# EAGLE design schematic (EAGLE 6.4)
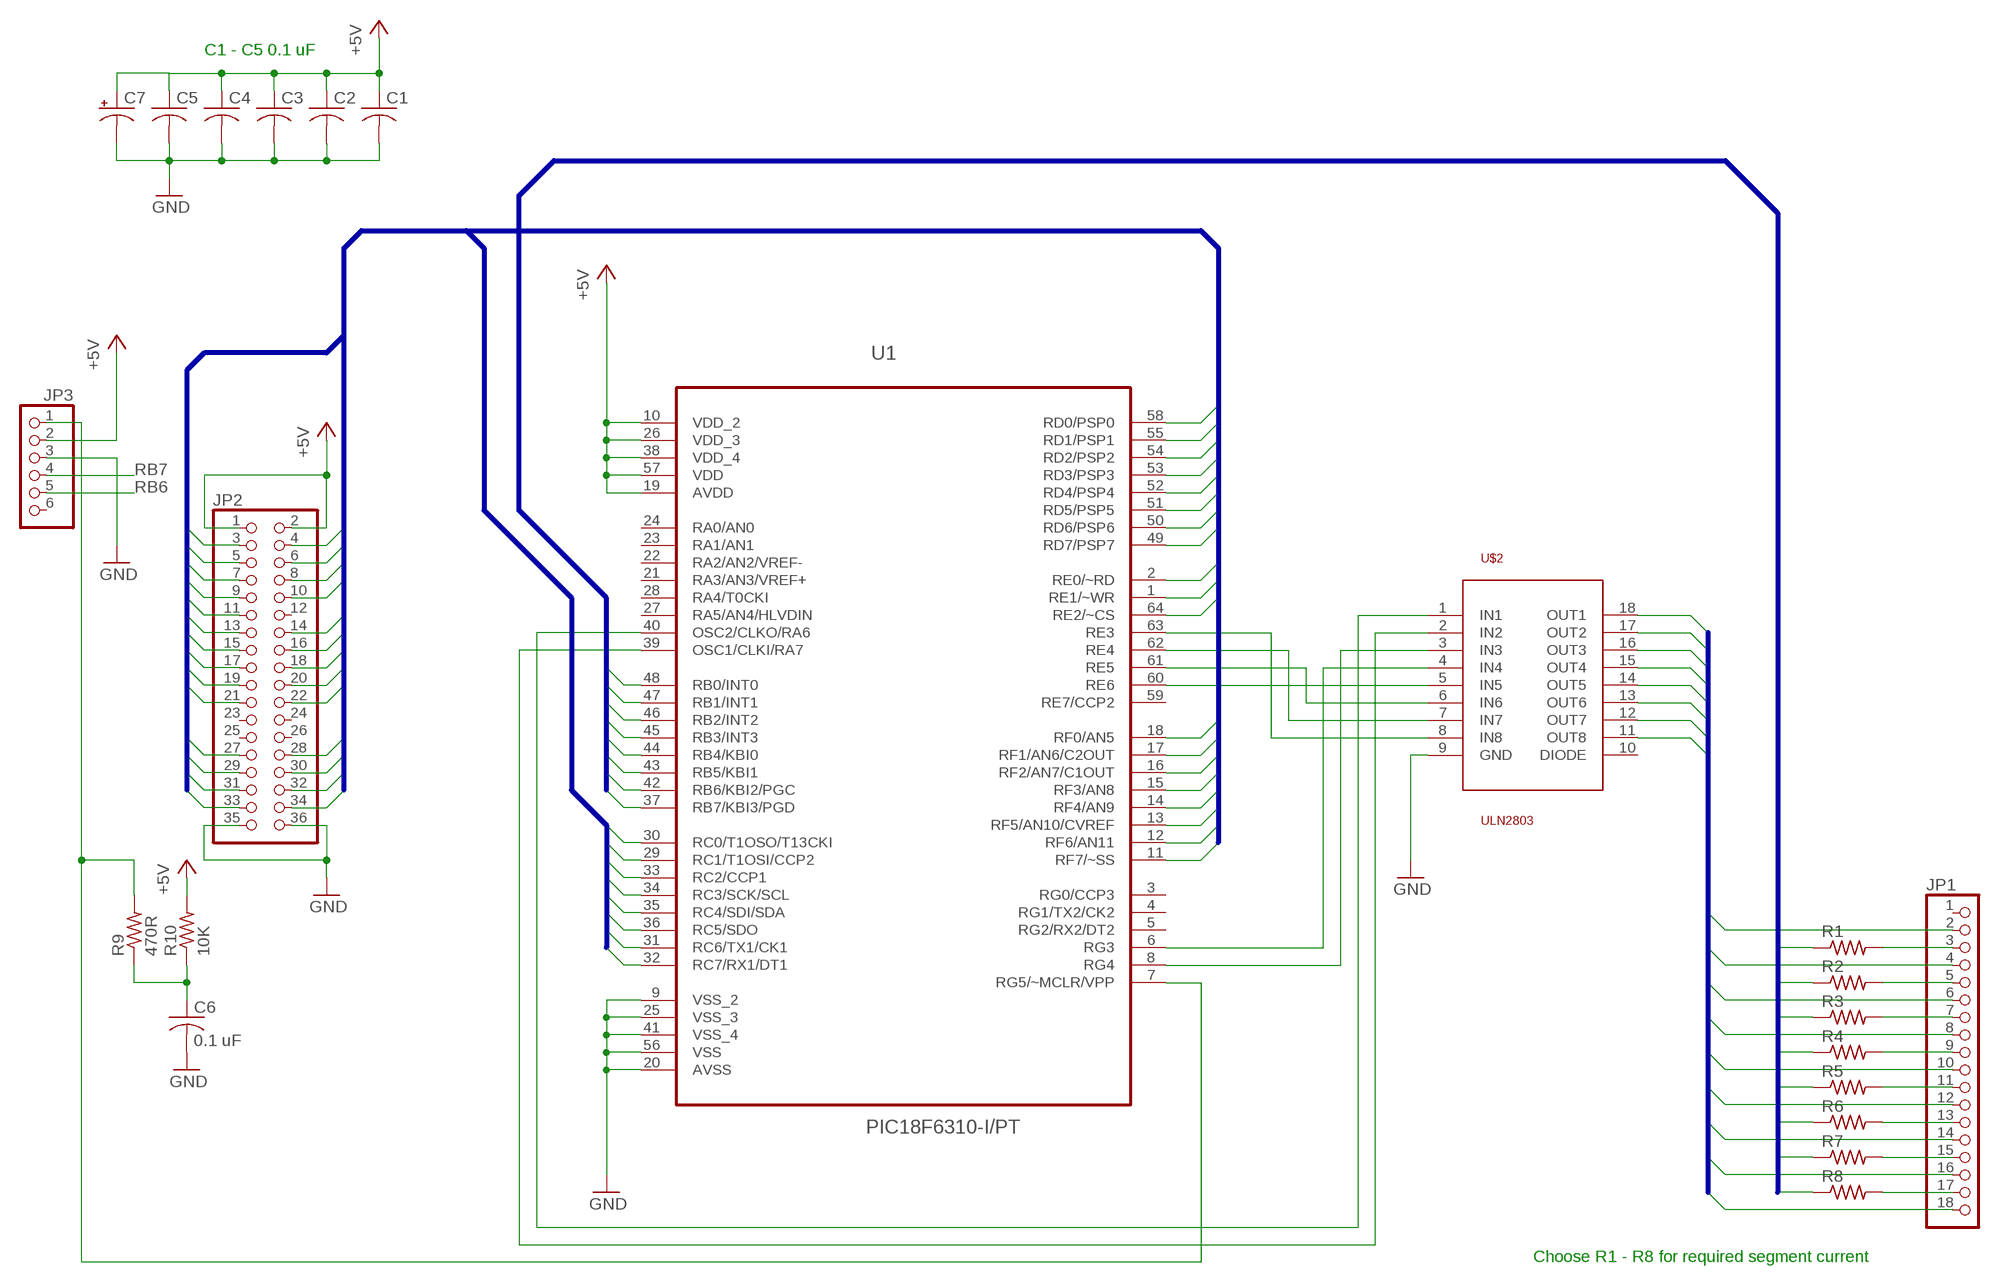
[diagram p0: schematic, sheet 1]

## Parts
C1  C-USC0603K  [C0603K]
C2  C-USC0603K  [C0603K]
C3  C-USC0603K  [C0603K]
C4  C-USC0603K  [C0603K]
C5  C-USC0603K  [C0603K]
C6  0.1 uF  C-USC0603K  [C0603K]
C7  CPOL-USB/3528-21W  [B/3528-21W]
JP1  PINHD-1X18  [1X18]
JP2  PINHD-2X18  [2X18]
JP3  PINHD-1X6  [1X06]
R1  R-US_R0603  [R0603]
R2  R-US_R0603  [R0603]
R3  R-US_R0603  [R0603]
R4  R-US_R0603  [R0603]
R5  R-US_R0603  [R0603]
R6  R-US_R0603  [R0603]
R7  R-US_R0603  [R0603]
R8  R-US_R0603  [R0603]
R9  470R  R-US_R0603  [R0603]
R10  10K  R-US_R0603  [R0603]
U1  PIC18F6310-I/PT  [QFP50P1200X1200X120-64N]
U$2  ULN2803  [SO18L]

## Nets
+5V: C1.1 C2.1 C3.1 C4.1 C5.1 C7.+ JP2.1 JP2.2 JP3.2 R10.2 U1.10(VDD_2) U1.19(AVDD) U1.26(VDD_3) U1.38(VDD_4) U1.57(VDD)
DIGIT0: JP1.2
DIGIT1: JP1.4 U$2.18(OUT1)
DIGIT2: JP1.6 U$2.17(OUT2)
DIGIT3: JP1.8 U$2.16(OUT3)
DIGIT4: JP1.10 U$2.15(OUT4)
DIGIT5: JP1.12 U$2.14(OUT5)
DIGIT6: JP1.14 U$2.13(OUT6)
DIGIT7: JP1.16 U$2.12(OUT7)
DIGIT8: JP1.18 U$2.11(OUT8)
GND: C1.2 C2.2 C3.2 C4.2 C5.2 C6.2 C7.- JP2.35 JP2.36 JP3.3 U1.9(VSS_2) U1.20(AVSS) U1.25(VSS_3) U1.41(VSS_4) U1.56(VSS) U$2.9(GND)
N$2: U1.63(RE3) U$2.8(IN8)
N$3: U1.62(RE4) U$2.7(IN7)
N$4: U1.61(RE5) U$2.6(IN6)
N$5: U1.60(RE6) U$2.5(IN5)
N$6: U1.40(OSC2/CLKO/RA6) U$2.1(IN1)
N$7: U1.39(OSC1/CLKI/RA7) U$2.2(IN2)
N$8: U1.6(RG3) U$2.4(IN4)
N$9: U1.8(RG4) U$2.3(IN3)
N$10: JP3.1 R9.2 U1.7(RG5/~MCLR/VPP)
N$12: JP1.3 R1.2
N$13: JP1.5 R2.2
N$14: JP1.7 R3.2
N$15: JP1.9 R4.2
N$16: JP1.11 R5.2
N$17: C6.1 R9.1 R10.1
N$18: JP1.13 R6.2
N$19: JP1.15 R7.2
N$20: JP1.17 R8.2
RB0: R1.1 U1.48(RB0/INT0)
RB1: R2.1 U1.47(RB1/INT1)
RB2: R3.1 U1.46(RB2/INT2)
RB3: R4.1 U1.45(RB3/INT3)
RB4: R5.1 U1.44(RB4/KBI0)
RB5: R6.1 U1.43(RB5/KBI1)
RB6: JP3.5 R7.1 U1.42(RB6/KBI2/PGC)
RB7: JP3.4 R8.1 U1.37(RB7/KBI3/PGD)
RC0: JP2.27 U1.30(RC0/T1OSO/T13CKI)
RC1: JP2.28 U1.29(RC1/T1OSI/CCP2)
RC2: JP2.29 U1.33(RC2/CCP1)
RC3: JP2.30 U1.34(RC3/SCK/SCL)
RC4: JP2.31 U1.35(RC4/SDI/SDA)
RC5: JP2.32 U1.36(RC5/SDO)
RC6: JP2.33 U1.31(RC6/TX1/CK1)
RC7: JP2.34 U1.32(RC7/RX1/DT1)
RD0: JP2.3 U1.58(RD0/PSP0)
RD1: JP2.4 U1.55(RD1/PSP1)
RD2: JP2.5 U1.54(RD2/PSP2)
RD3: JP2.6 U1.53(RD3/PSP3)
RD4: JP2.7 U1.52(RD4/PSP4)
RD5: JP2.8 U1.51(RD5/PSP5)
RD6: JP2.9 U1.50(RD6/PSP6)
RD7: JP2.10 U1.49(RD7/PSP7)
RE0: JP2.13 U1.2(RE0/~RD)
RE1: JP2.14 U1.1(RE1/~WR)
RE2: JP2.11 U1.64(RE2/~CS)
RF0: JP2.15 U1.18(RF0/AN5)
RF1: JP2.16 U1.17(RF1/AN6/C2OUT)
RF2: JP2.17 U1.16(RF2/AN7/C1OUT)
RF3: JP2.18 U1.15(RF3/AN8)
RF4: JP2.19 U1.14(RF4/AN9)
RF5: JP2.20 U1.13(RF5/AN10/CVREF)
RF6: JP2.21 U1.12(RF6/AN11)
RF7: JP2.22 U1.11(RF7/~SS)
Unconnected: JP1.1 JP2.12 JP2.23 JP2.24 JP2.25 JP2.26 JP3.6 U1.3(RG0/CCP3) U1.4(RG1/TX2/CK2) U1.5(RG2/RX2/DT2) U1.21(RA3/AN3/VREF+) U1.22(RA2/AN2/VREF-) U1.23(RA1/AN1) U1.24(RA0/AN0) U1.27(RA5/AN4/HLVDIN) U1.28(RA4/T0CKI) U1.59(RE7/CCP2) U$2.10(DIODE)

## Buses
CATHODES
PORTB
EXPANSION

## Notes on the sheet
- C1 - C5 0.1 uF
- Choose R1 - R8 for required segment current

## Library data of the parts
C1-C6 = resistor:C-US: CAPACITOR, American symbol
C7 = resistor:CPOL-US: POLARIZED CAPACITOR, American symbol
JP1 = pinhead:PINHD-1X18: PIN HEADER
JP2 = pinhead:PINHD-2X18: PIN HEADER
JP3 = pinhead:PINHD-1X6: PIN HEADER
R1-R10 = resistor:R-US_: RESISTOR, American symbol
U1 = pic18f6310:PIC18F6310-I/PT: IC PIC MCU; MPN: PIC18F6310-I/PT; OC_FARNELL: 1332276; OC_NEWARK: 08J9637; PACKAGE: QFP-64; SUPPLIER: Microchip
U$2 = uln2803:ULN2803

## Board
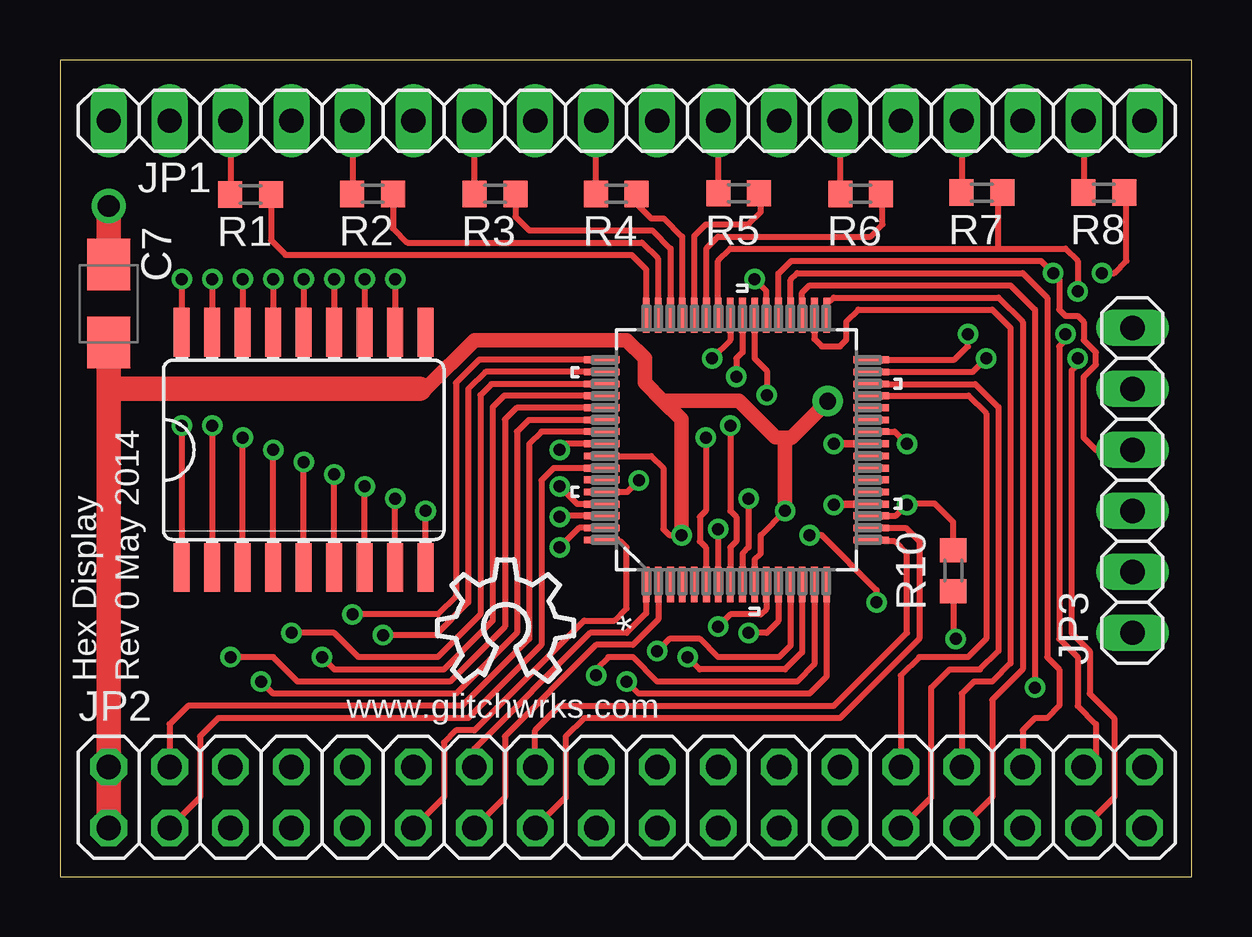
[diagram p1: board, top side]
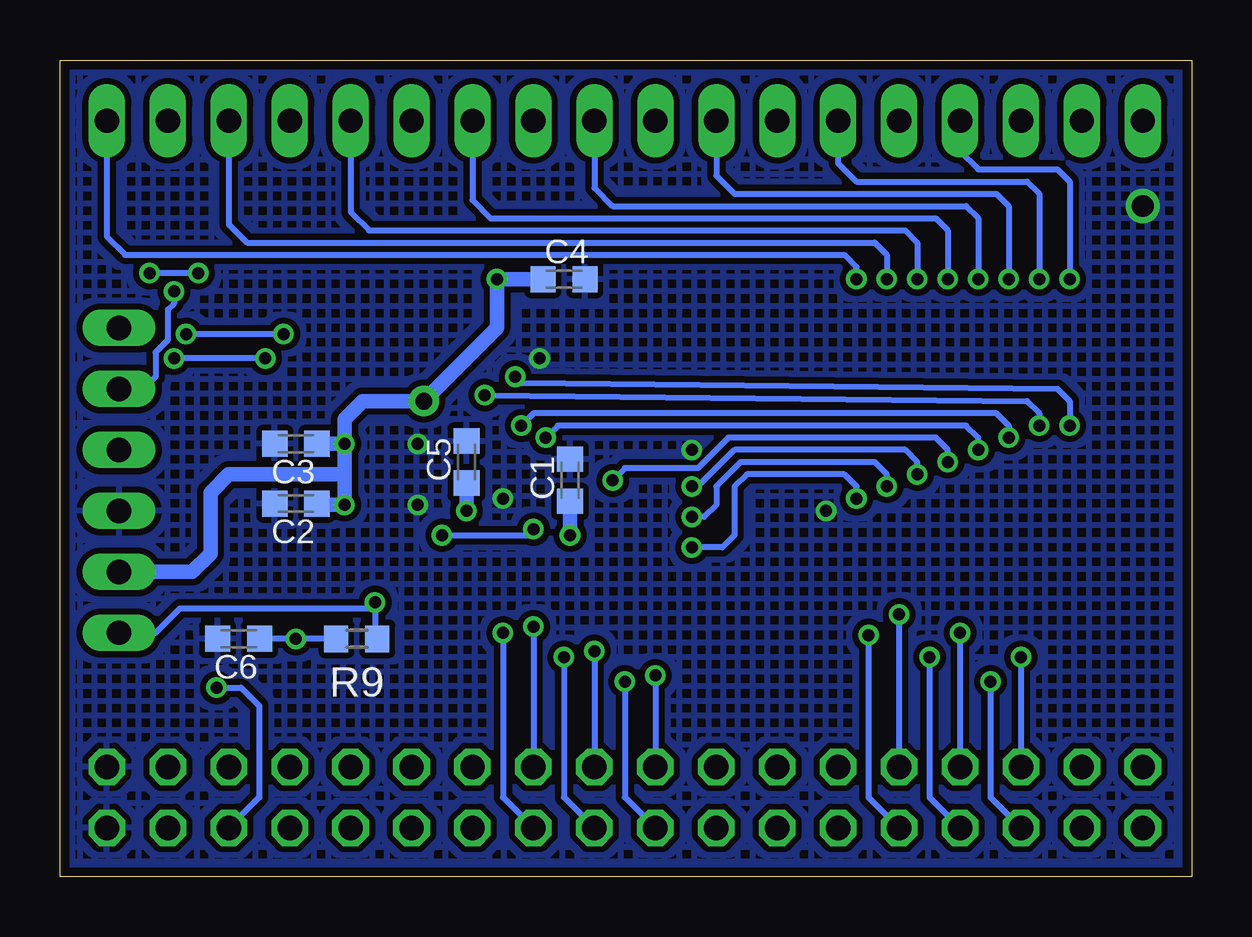
[diagram p2: board, bottom side, seen from below]

Size 47.17 x 34.03 mm. Coordinates in mm from the lower left corner, seen from the top.
Outline: 0,0 47.17,0 47.17,34.03 0,34.03 0,0
Copper layers (1*16): Top 0.0356mm / dielectric 1.5011mm / Bottom 0.0356mm
Design rules "LaenPCBOrder": minimum track width 6mil, minimum drill 13mil, track to track 6mil, track to pad 6mil, pad to pad 6mil, via to via 6mil, smd to smd 6mil, copper to edge 15mil, drill to drill 6mil, minimum pad ring 7mil, minimum via ring 7mil, stop-mask expansion 3mil, vias tented up to drill 0mil, thermal gap 10mil

### Footprints (pad centres in the part's own frame; a part is rotated, then mirrored left to right if it is on the bottom)
C0603K = smd 1.05 x 1.08: 1 -0.875,0; 2 0.875,0
B/3528-21W = smd 2.15 x 1.8: + 1.625,0; - -1.625,0
1X18 = drill 1.016 long: 1 -21.59,0; 2 -19.05,0; 3 -16.51,0; 4 -13.97,0; 5 -11.43,0; 6 -8.89,0; 7 -6.35,0; 8 -3.81,0; 9 -1.27,0; 10 1.27,0; 11 3.81,0; 12 6.35,0; 13 8.89,0; 14 11.43,0; 15 13.97,0; 16 16.51,0; 17 19.05,0; 18 21.59,0
2X18 = drill 1.016 octagon: 1 -21.59,-1.27; 2 -21.59,1.27; 3 -19.05,-1.27; 4 -19.05,1.27; 5 -16.51,-1.27; 6 -16.51,1.27; 7 -13.97,-1.27; 8 -13.97,1.27; 9 -11.43,-1.27; 10 -11.43,1.27; 11 -8.89,-1.27; 12 -8.89,1.27; 13 -6.35,-1.27; 14 -6.35,1.27; 15 -3.81,-1.27; 16 -3.81,1.27; 17 -1.27,-1.27; 18 -1.27,1.27; 19 1.27,-1.27; 20 1.27,1.27; 21 3.81,-1.27; 22 3.81,1.27; 23 6.35,-1.27; 24 6.35,1.27; 25 8.89,-1.27; 26 8.89,1.27; 27 11.43,-1.27; 28 11.43,1.27; 29 13.97,-1.27; 30 13.97,1.27; 31 16.51,-1.27; 32 16.51,1.27; 33 19.05,-1.27; 34 19.05,1.27; 35 21.59,-1.27; 36 21.59,1.27
1X06 = drill 1.016 long: 1 -6.35,0; 2 -3.81,0; 3 -1.27,0; 4 1.27,0; 5 3.81,0; 6 6.35,0
R0603 = smd 1 x 1.1: 1 -0.85,0; 2 0.85,0
QFP50P1200X1200X120-64N = smd 1.473 x 0.279: 1 -5.613,3.759; 2 -5.613,3.251; 3 -5.613,2.743; 4 -5.613,2.261; 5 -5.613,1.753; 6 -5.613,1.245; 7 -5.613,0.762; 8 -5.613,0.254; 9 -5.613,-0.254; 10 -5.613,-0.762; 11 -5.613,-1.245; 12 -5.613,-1.753; 13 -5.613,-2.261; 14 -5.613,-2.743; 15 -5.613,-3.251; 16 -5.613,-3.759; 33 5.613,-3.759; 34 5.613,-3.251; 35 5.613,-2.743; 36 5.613,-2.261; 37 5.613,-1.753; 38 5.613,-1.245; 39 5.613,-0.762; 40 5.613,-0.254; 41 5.613,0.254; 42 5.613,0.762; 43 5.613,1.245; 44 5.613,1.753; 45 5.613,2.261; 46 5.613,2.743; 47 5.613,3.251; 48 5.613,3.759 | smd 0.279 x 1.473: 17 -3.759,-5.613; 18 -3.251,-5.613; 19 -2.743,-5.613; 20 -2.261,-5.613; 21 -1.753,-5.613; 22 -1.245,-5.613; 23 -0.762,-5.613; 24 -0.254,-5.613; 25 0.254,-5.613; 26 0.762,-5.613; 27 1.245,-5.613; 28 1.753,-5.613; 29 2.261,-5.613; 30 2.743,-5.613; 31 3.251,-5.613; 32 3.759,-5.613; 49 3.759,5.613; 50 3.251,5.613; 51 2.743,5.613; 52 2.261,5.613; 53 1.753,5.613; 54 1.245,5.613; 55 0.762,5.613; 56 0.254,5.613; 57 -0.254,5.613; 58 -0.762,5.613; 59 -1.245,5.613; 60 -1.753,5.613; 61 -2.261,5.613; 62 -2.743,5.613; 63 -3.251,5.613; 64 -3.759,5.613
SO18L = smd 0.66 x 2.032: 1 -5.08,-4.902; 2 -3.81,-4.902; 3 -2.54,-4.902; 4 -1.27,-4.902; 5 0,-4.902; 6 1.27,-4.902; 7 2.54,-4.902; 8 3.81,-4.902; 9 5.08,-4.902; 10 5.08,4.902; 11 3.81,4.902; 12 2.54,4.902; 13 1.27,4.902; 14 0,4.902; 15 -1.27,4.902; 16 -2.54,4.902; 17 -3.81,4.902; 18 -5.08,4.902

### Placement (x,y rotation side)
C1  25.91,16.51 90 bottom
C2  37.34,15.54 180 bottom
C3  37.34,18.03 180 bottom
C4  26.16,24.89 0 bottom
C5  30.23,17.27 90 bottom
C6  39.73,9.91 180 bottom
C7  2.03,23.88 270 top
JP1  23.62,31.5 0 top
JP2  23.62,3.3 0 top
JP3  44.7,16.51 90 top
R1  7.95,28.42 180 top
R2  13.03,28.45 180 top
R3  18.14,28.45 180 top
R4  23.19,28.45 180 top
R5  28.3,28.47 180 top
R6  33.38,28.45 180 top
R7  38.43,28.5 180 top
R8  43.51,28.5 180 top
R9  34.8,9.91 0 bottom
R10  37.24,12.75 90 top
U1  28.19,17.78 90 top
U$1  [OSHW_8X200_NOTEXT]  15.75,8.13 0 top
U$2  10.16,17.78 0 top

### Tracks (layer width: path | path; a pad name or v marks a point on that pad's centre or on a via)
+5V  (via drill 0.5, 0.7 pad 1.27)
  Top 0.254: v30.23,15.24 29.21,14.22 29.21,13.46 28.96,13.21 U1.10 | v35.31,18.03 34.8,18.54 U1.26 | v28.96,24.89 29.44,24.41 U1.38 | U1.19 34.85,15.04 v35.31,15.49 35.36,15.54 C2.1 37.24,14.77 R10.2 | U1.57 24.64,17.53 25.15,17.02 25.15,14.48 25.4,14.22 v25.91,14.22
  Top 0.61: 14.99,20.32 15.24,20.32 17.27,22.35 23.62,22.35 24.38,21.59 24.38,20.57 25.12,19.84 | v25.91,14.22 25.91,19.05 25.12,19.84 | v32,19.81 30.48,18.29 30.23,18.29 | 30.23,18.29 29.82,18.31 28.3,19.84 25.12,19.84 | v30.23,15.24 30.23,18.29
  Top 1.016: JP2.1 JP2.2 2.03,20.57 | 2.03,20.57 C7.+ | 14.99,20.32 2.29,20.32 2.03,20.57
  Bottom 0.254: 25.77,15.49 C1.1
  Bottom 0.61: v35.31,18.03 35.31,16.76 | 35.31,16.76 v35.31,15.49 36.41,15.49 C2.1 | v35.31,18.03 35.31,19.05 34.54,19.81 v32,19.81 28.96,22.86 v28.96,24.89 C4.1 | v35.31,18.03 C3.1 | v30.23,15.24 C5.1 | C1.1 v25.91,14.22 | JP3.2 41.66,12.7 40.89,13.46 40.89,16 40.13,16.76 35.31,16.76
DIGIT1  (via drill 0.5)
  Top 0.254: v5.08,24.89 U$2.18
  Bottom 0.254: v5.08,24.89 5.08,28.96 5.59,29.46 8.89,29.46 9.65,30.23 JP1.4
DIGIT2  (via drill 0.5)
  Top 0.254: v6.35,24.89 U$2.17
  Bottom 0.254: v6.35,24.89 6.35,28.45 6.86,28.96 13.97,28.96 14.73,29.72 JP1.6
DIGIT3  (via drill 0.5)
  Top 0.254: v7.62,24.89 U$2.16
  Bottom 0.254: v7.62,24.89 7.62,27.94 8.13,28.45 19.05,28.45 19.81,29.21 JP1.8
DIGIT4  (via drill 0.5)
  Top 0.254: v8.89,24.89 U$2.15
  Bottom 0.254: v8.89,24.89 8.89,27.43 9.4,27.94 24.13,27.94 24.89,28.7 JP1.10
DIGIT5  (via drill 0.5)
  Top 0.254: v10.16,24.89 U$2.14
  Bottom 0.254: v10.16,24.89 10.16,26.92 10.67,27.43 29.21,27.43 29.97,28.19 JP1.12
DIGIT6  (via drill 0.5)
  Top 0.254: v11.43,24.89 U$2.13
  Bottom 0.254: v11.43,24.89 11.43,26.42 11.94,26.92 34.29,26.92 35.05,27.69 JP1.14
DIGIT7  (via drill 0.5)
  Top 0.254: v12.7,24.89 U$2.12
  Bottom 0.254: v12.7,24.89 12.7,25.91 13.21,26.42 39.37,26.42 40.13,27.18 JP1.16
DIGIT8  (via drill 0.5)
  Top 0.254: v13.97,24.89 U$2.11
  Bottom 0.254: v13.97,24.89 13.97,25.4 14.48,25.91 44.45,25.91 45.21,26.67 JP1.18
GND  (via drill 0.5, 0.5 pad 0.41, 0.9 pad 1.42)
  Top 0.254: U$2.9 v15.24,15.24 | v28.7,15.75 28.7,13.72 28.45,13.46 U1.9 | U1.56 21.08,18.03 v20.83,17.78 | U1.41 27.94,22.35 v27.18,21.59
  Top 0.305: U1.20 32.28,15.52 v32.26,15.49 | U1.25 v32.26,18.03
  Top 1.016: v2.03,27.94 C7.-
  pour Bottom (isolate 0.254, hatched): 0,34.04 0,0 47.24,0 47.24,34.04
N$2  (via drill 0.5)
  Top 0.254: U$2.8 v13.97,15.75 | U1.63 21.64,14.53 v20.83,13.72
  Bottom 0.254: v13.97,15.75 13.97,16.26 14.48,16.76 18.54,16.76 19.05,16.26 19.05,14.22 19.56,13.72 v20.83,13.72
N$3  (via drill 0.5)
  Top 0.254: U$2.7 v12.7,16.26 | U1.62 20.88,15.04 v20.83,14.99
  Bottom 0.254: v12.7,16.26 12.7,16.76 13.21,17.27 18.8,17.27 19.81,16.26 19.81,15.49 20.32,14.99 v20.83,14.99
N$4  (via drill 0.5)
  Top 0.254: U$2.6 v11.43,16.76 | U1.61 21.57,15.52 v20.83,16.26
  Bottom 0.254: v11.43,16.76 11.43,17.27 11.94,17.78 19.05,17.78 20.57,16.26 v20.83,16.26
N$5  (via drill 0.5)
  Top 0.254: U1.60 23.65,16.03 v24.13,16.51 | U$2.5 v10.16,17.27
  Bottom 0.254: v10.16,17.27 10.16,17.78 10.67,18.29 19.3,18.29 20.57,17.02 23.62,17.02 v24.13,16.51
N$6  (via drill 0.5)
  Top 0.254: U1.40 28.45,21.84 28.19,21.59 v28.19,20.83 | v5.08,18.8 U$2.1
  Bottom 0.254: v28.19,20.83 27.94,20.57 5.59,20.32 5.08,19.81 v5.08,18.8
N$7  (via drill 0.5)
  Top 0.254: U1.39 28.96,21.59 29.46,21.08 v29.46,20.07 | v6.35,18.8 U$2.2
  Bottom 0.254: v29.46,20.07 6.86,19.81 6.35,19.3 v6.35,18.8
N$8  (via drill 0.5)
  Top 0.254: U$2.4 v8.89,17.78 | v26.92,18.29 26.92,15.24 26.67,14.99 26.67,13.97 26.92,13.72 26.92,12.19 U1.6
  Bottom 0.254: v8.89,17.78 8.89,18.29 9.4,18.8 26.42,18.8 v26.92,18.29
N$9  (via drill 0.5)
  Top 0.254: U$2.3 v7.62,18.29 | v27.94,18.8 27.94,15.24 28.19,14.99 28.19,13.97 27.94,13.72 U1.8
  Bottom 0.254: v27.94,18.8 27.43,19.3 8.13,19.3 7.62,18.8 v7.62,18.29
N$10  (via drill 0.5)
  Top 0.254: v31.24,14.22 31.75,14.22 34.04,11.94 v34.04,11.43 | v27.43,14.48 U1.7
  Bottom 0.254: v31.24,14.22 27.69,14.22 v27.43,14.48 | R9.2 34.04,9.99 v34.04,11.43 34.29,11.18 42.16,11.18 43.18,10.16 JP3.1
N$12
  Top 0.254: JP1.3 7.11,28.43 R1.2
N$13
  Top 0.254: JP1.5 12.19,28.46 R2.2
N$14
  Top 0.254: R3.2 17.29,31.48 JP1.7
N$15
  Top 0.254: R4.2 22.34,31.48 JP1.9
N$16
  Top 0.254: JP1.11 27.43,28.49 R5.2
N$17  (via drill 0.5)
  Top 0.254: R10.1 37.24,10.01 v37.34,9.91
  Bottom 0.254: R9.1 v37.34,9.91 C6.1
N$18
  Top 0.254: JP1.13 32.51,28.46 R6.2
N$19
  Top 0.254: JP1.15 37.59,28.51 R7.2
N$20
  Top 0.254: JP1.17 42.67,28.51 R8.2
RB0
  Top 0.254: U1.48 24.43,25.3 23.82,25.91 9.4,25.91 8.8,26.51 R1.1
RB1
  Top 0.254: U1.47 24.92,23.42 24.92,25.76 24.26,26.42 14.48,26.42 13.88,27.01 R2.1
RB2
  Top 0.254: U1.46 25.45,26.16 24.69,26.92 19.56,26.92 18.99,27.5 R3.1
RB3
  Top 0.254: U1.45 25.93,26.67 25.17,27.43 24.64,27.43 24.04,28.03 R4.1
RB4
  Top 0.254: U1.44 26.44,26.7 26.92,27.18 28.7,27.18 29.21,27.69 29.21,28.41 R5.1
RB5
  Top 0.254: U1.43 26.95,26.19 27.43,26.67 33.78,26.67 34.29,27.18 34.29,28.38 R6.1
RB6  (via drill 0.5)
  Top 0.254: U1.42 27.43,25.65 27.94,26.16 39.12,26.16 | 39.12,26.16 39.12,28.34 R7.1 | 39.12,26.16 41.91,26.16 42.42,25.65 v42.42,24.38
  Bottom 0.254: JP3.5 43.69,20.32 43.18,20.83 43.18,21.84 42.67,22.35 42.67,23.62 42.42,23.88 v42.42,24.38
RB7  (via drill 0.5)
  Top 0.254: U1.37 29.95,25.12 30.48,25.65 40.89,25.65 v41.4,25.15 41.66,24.89 41.66,23.62 41.91,23.37 42.42,23.37 42.67,23.11 42.67,22.35 43.18,21.84 43.18,21.34 42.67,20.83 42.67,18.29 43.18,17.78 JP3.4 | R8.1 44.45,28.41 44.45,25.65 43.94,25.15 v43.43,25.15
  Bottom 0.254: v41.4,25.15 v43.43,25.15
RC0
  Top 0.254: U1.30 38.15,20.52 39.12,19.56 39.12,9.4 38.35,8.64 37.08,8.64 36.32,7.87 36.32,3.3 JP2.27
RC1
  Top 0.254: U1.29 37.87,20.04 38.61,19.3 38.61,9.91 37.85,9.14 35.81,9.14 35.05,8.38 JP2.28
RC2
  Top 0.254: JP2.29 38.86,3.3 38.86,7.37 40.13,8.64 40.13,23.11 39.12,24.13 32.26,24.13 31.95,23.82 U1.33
RC3
  Top 0.254: JP2.30 37.59,7.62 38.1,8.13 38.86,8.13 39.62,8.89 39.62,22.86 38.86,23.62 33.27,23.62 32.77,23.11 32.77,22.35 32.51,22.1 31.75,22.1 31.45,22.4 U1.34
RC4  (via drill 0.5)
  Top 0.254: U1.35 30.94,24.33 31.24,24.64 39.62,24.64 40.64,23.62 v40.64,7.87
  Bottom 0.254: v40.64,7.87 39.62,7.87 38.86,7.11 38.86,3.3 JP2.31
RC5
  Top 0.254: U1.36 30.45,24.87 30.73,25.15 40.13,25.15 41.15,24.13 41.15,9.14 41.66,8.64 41.66,7.11 41.15,6.6 40.64,6.6 40.13,6.1 JP2.32
RC6  (via drill 0.5)
  Top 0.254: U1.31 38.05,21.03 v38.61,21.59 | JP2.33 43.94,3.3 43.94,6.6 42.93,7.62 42.93,9.4 42.16,10.16 42.16,21.08 42.42,21.34 v42.42,21.59
  Bottom 0.254: v38.61,21.59 v42.42,21.59
RC7  (via drill 0.5)
  Top 0.254: JP2.34 43.18,5.08 43.18,6.35 42.42,7.11 42.42,9.14 41.66,9.91 41.66,22.1 41.91,22.35 v41.91,22.61 | U1.32 37.29,21.54 37.85,22.1 v37.85,22.61
  Bottom 0.254: v37.85,22.61 v41.91,22.61
RD0
  Top 0.254: U1.58 20.57,17.02 20.07,16.51 20.07,9.65 17.02,6.6 6.6,6.6 5.84,5.84 5.84,3.3 JP2.3
RD1
  Top 0.254: U1.55 20.07,18.54 19.56,18.03 19.56,9.91 16.76,7.11 5.33,7.11 4.57,6.35 JP2.4
RD2  (via drill 0.5)
  Top 0.254: U1.54 19.53,19.02 19.05,18.54 19.05,10.16 16.51,7.62 8.89,7.62 v8.38,8.13
  Bottom 0.254: v8.38,8.13 8.38,3.3 JP2.5
RD3  (via drill 0.5)
  Top 0.254: U1.53 19.02,19.53 18.54,19.05 18.54,10.41 16.26,8.13 9.91,8.13 8.89,9.14 v7.11,9.14
  Bottom 0.254: v7.11,9.14 JP2.6
RD4  (via drill 0.5)
  Top 0.254: U1.52 18.52,20.04 18.03,19.56 18.03,10.67 16,8.64 11.43,8.64 v10.92,9.14
  Bottom 0.254: v10.92,9.14 10.92,3.3 JP2.7
RD5  (via drill 0.5)
  Top 0.254: U1.51 17.98,20.52 17.53,20.07 17.53,10.92 15.75,9.14 12.45,9.14 11.43,10.16 v9.65,10.16
  Bottom 0.254: v9.65,10.16 JP2.8
RD6  (via drill 0.5)
  Top 0.254: U1.50 17.73,21.03 17.02,20.32 17.02,11.43 15.65,10.06 v13.46,10.06
  Bottom 0.254: v13.46,10.06 13.46,3.3 JP2.9
RD7  (via drill 0.5)
  Top 0.254: U1.49 17.48,21.54 16.51,20.57 16.51,11.68 15.75,10.92 v12.19,10.92
  Bottom 0.254: v12.19,10.92 JP2.10
RE0
  Top 0.254: U1.2 24.94,10.72 23.88,9.65 22.35,9.65 18.54,5.84 18.54,3.3 JP2.13
RE1
  Top 0.254: U1.1 24.43,10.97 23.62,10.16 22.1,10.16 17.27,5.33 JP2.14
RE2
  Top 0.254: 22.15,14.02 U1.64 22.63,13.97 23.37,13.97 23.62,13.72 23.62,11.18 23.11,10.67 21.84,10.67 17.27,6.1 16.51,6.1 16,5.59 16,3.3 JP2.11
RF0
  Top 0.254: U1.18 35.26,14.53 35.81,13.97 35.81,9.91 32.51,6.6 21.84,6.6 21.08,5.84 21.08,3.3 JP2.15
RF1
  Top 0.254: JP2.16 19.81,6.1 20.83,7.11 32.26,7.11 35.31,10.16 35.31,13.46 34.8,13.97 33.86,13.97 U1.17
RF2  (via drill 0.5)
  Top 0.254: U1.16 31.95,8.33 31.24,7.62 24.13,7.62 v23.62,8.13
  Bottom 0.254: v23.62,8.13 23.62,3.3 JP2.17
RF3  (via drill 0.5)
  Top 0.254: U1.15 31.45,8.84 30.73,8.13 24.89,8.13 23.88,9.14 22.86,9.14 22.35,8.64 v22.35,8.38
  Bottom 0.254: v22.35,8.38 JP2.18
RF4  (via drill 0.5)
  Top 0.254: U1.14 30.94,9.35 30.23,8.64 26.67,8.64 v26.16,9.14
  Bottom 0.254: v26.16,9.14 26.16,3.3 JP2.19
RF5  (via drill 0.5)
  Top 0.254: U1.13 30.45,9.63 29.97,9.14 27.43,9.14 26.67,9.91 25.4,9.91 v24.89,9.4
  Bottom 0.254: v24.89,9.4 JP2.20
RF6  (via drill 0.5)
  Top 0.254: U1.12 29.95,10.64 29.46,10.16 v28.7,10.16
  Bottom 0.254: v28.7,10.16 28.7,3.3 JP2.21
RF7  (via drill 0.5)
  Top 0.254: U1.11 29.44,11.15 29.21,10.92 27.94,10.92 v27.43,10.41
  Bottom 0.254: v27.43,10.41 JP2.22

### Text on the board
_tsilk: Hex Display | Rev 0 May 2014 | www.glitchwrks.com